# EasyEDA Pro project ProDoc_PCB1_2026-03-28.epro

# Board PCB1
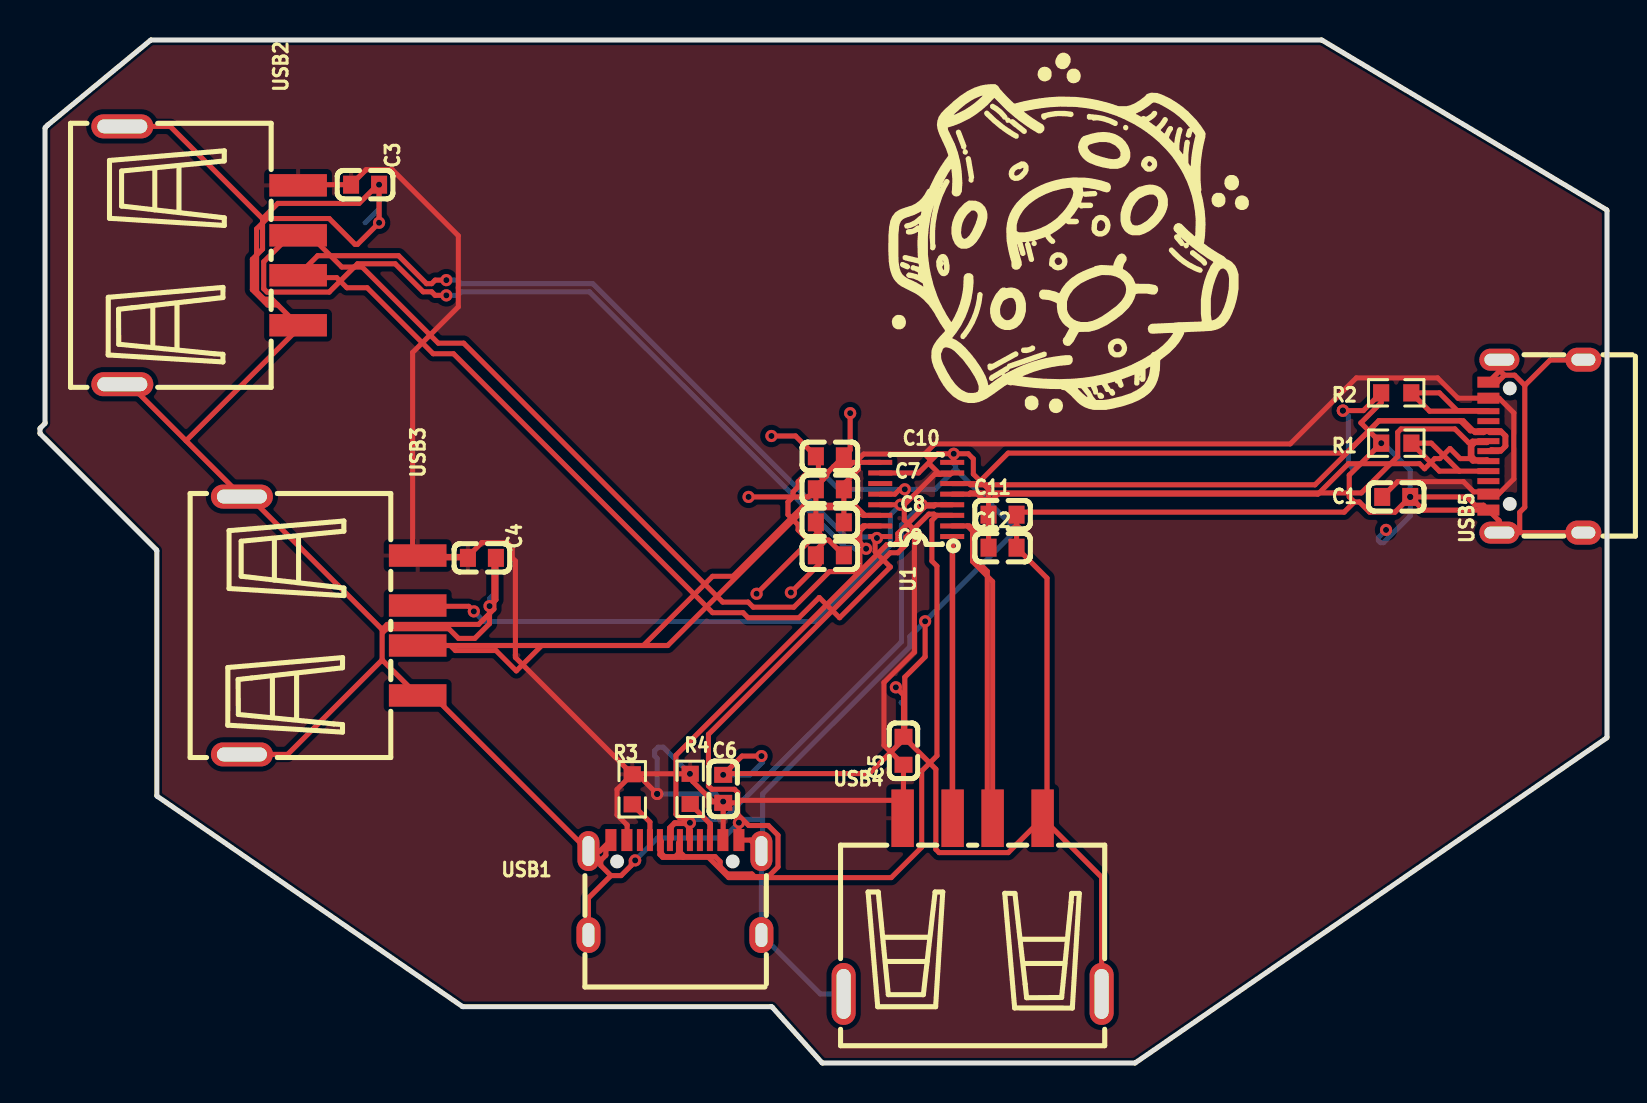
[diagram p0: board, top side]
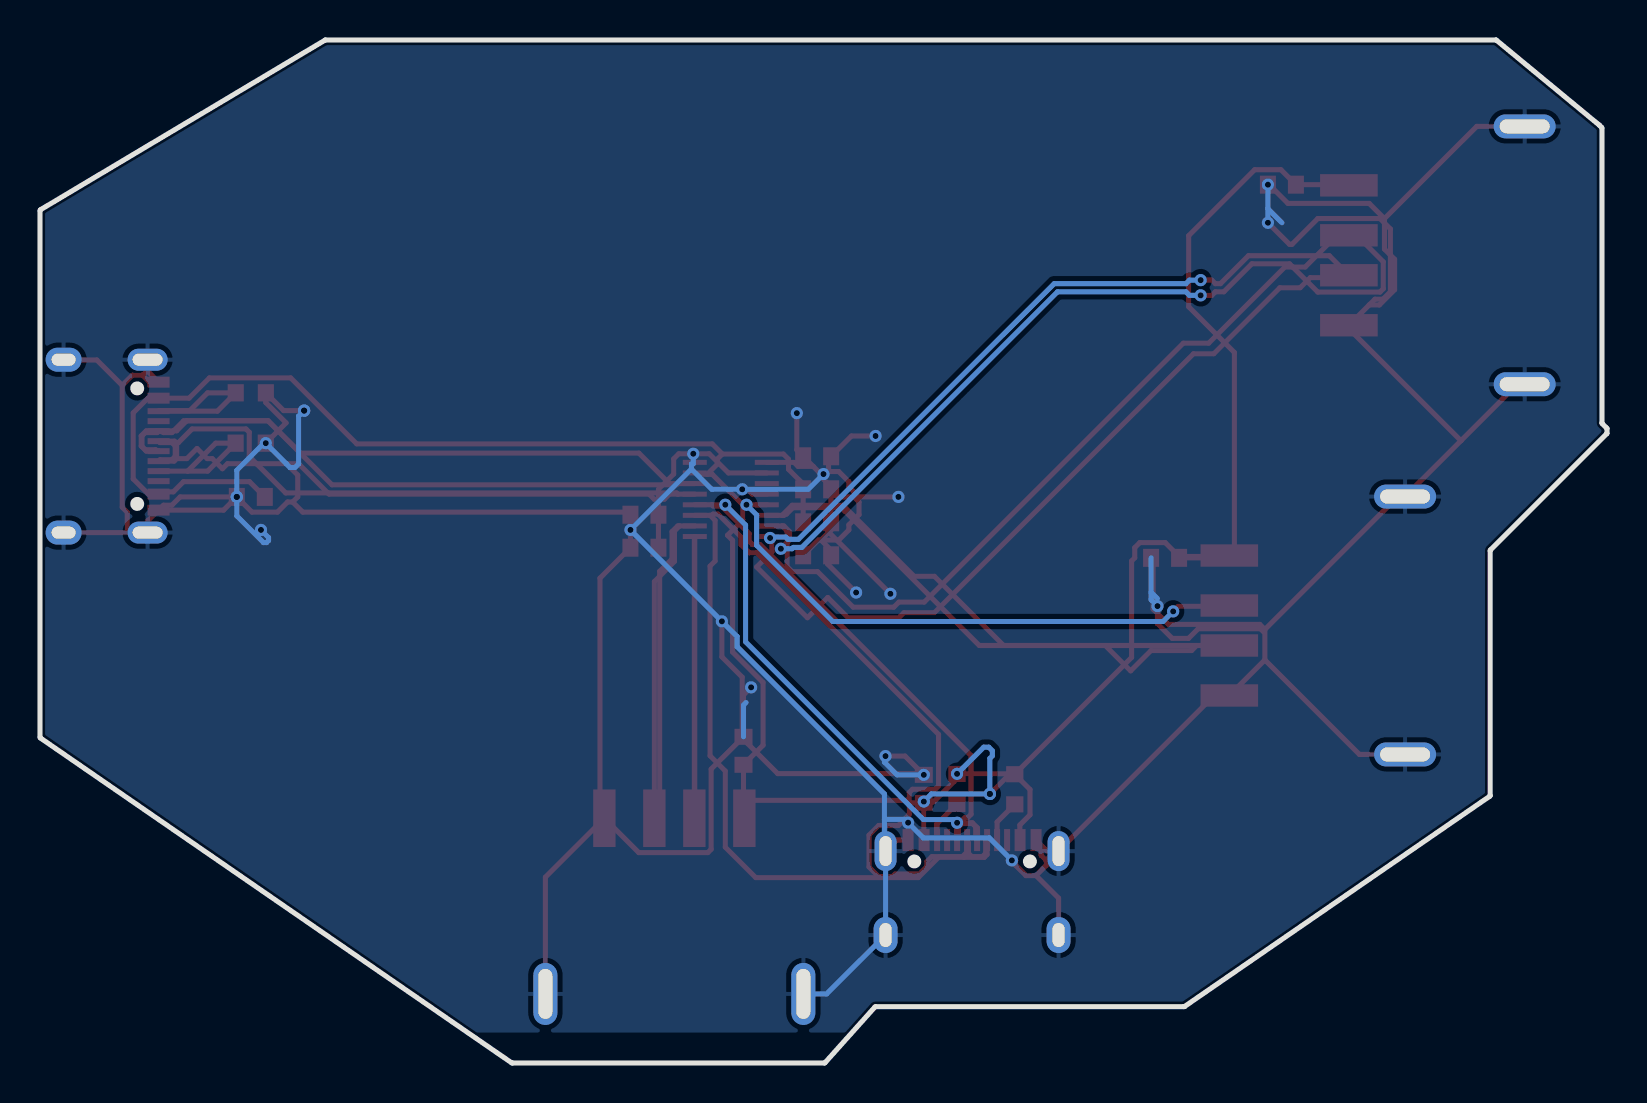
[diagram p1: board, bottom side, seen from below]

Outline 78.36 x 51.18 mm; copper layers: Top Layer, Bottom Layer. Coordinates in mm from the lower left corner of the outline.
Outline path: 0,31.73 arc(0,31.75) 0.02,31.77 0.24,31.99 arc(0.25,32.01) 0.25,32.03 0.25,46.77 arc(0.26,46.79) 0.27,46.81 0.38,46.92 arc(0.38,46.92) 0.38,46.92 5.53,51.17 arc(5.54,51.18) 5.56,51.18 64.08,51.18 arc(64.09,51.18) 64.1,51.17 78.33,42.69 arc(78.35,42.67) 78.36,42.64 78.36,16.3 arc(78.35,16.28) 78.34,16.26 54.77,0.01 arc(54.76,0) 54.74,0 39.14,0 arc(39.12,0) 39.1,0.02 36.61,2.8 arc(36.59,2.82) 36.57,2.82 21.15,2.82 arc(21.14,2.82) 21.12,2.83 5.86,13.35 arc(5.85,13.36) 5.84,13.39 5.84,25.63 arc(5.84,25.65) 5.83,25.67 0.02,31.48 arc(0,31.5) 0,31.52 0,31.73
Stack: Top Layer 0.035mm / Dielectric1 1.51mm FR4 er 4.5 / Bottom Layer 0.035mm

## Design rules (mm)
net DN2: DP3
net DP2: DP3
net DN1: DP2
net DP1: DP2
net DN: DP1
net DP: DP1
net DN4: DP5
net DP4: DP5
net DN3: DP4
net DP3: DP4
template: Custom Config
spacing copperThickness1oz (default): track to track 0.102, other pairs 0.152 to 0.3
spacing copperThickness2oz: track to track 0.203, other pairs 0.152 to 0.3
track width copperThickness1oz (default): min 0.127, default 0.254, max 2.54
track width copperThickness2oz: min 0.203, default 0.254, max 2.54
differential pair differentialPair (default): width min 0.127, default 0.254, max 2.54; gap min 0.152, default 0.152
via viaSize (default): diameter min 0.5, default 0.61, max 10; hole min 0.3, default 0.305, max 6.3

## Placement (name value [footprint] x y rotation side)
C1  1uf  [C0603]  67.82 28.32 0 top
C3  1uf  [C0603]  16.26 43.94 0 top
C4  1uf  [C0603]  22.1 25.27 0 top
C5  1uf  [C0603]  43.18 15.62 90 top
C6  1uf  [C0603]  34.16 13.72 90 top
C7  100nf  [C0603]  39.5 28.7 180 top
C8  1uf  [C0603]  39.5 27.05 180 top
C9  100nf  [C0603]  39.5 25.4 180 top
C10  1uf  [C0603]  39.5 30.35 180 top
C11  100nf  [C0603]  48.13 27.43 0 top
C12  1uf  [C0603]  48.13 25.78 0 top
R1  5.1K  [R0603]  67.82 31.01 0 top
R2  5.1K  [R0603]  67.82 33.53 0 top
R3  5.1K  [R0603]  29.62 13.69 90 top
R4  5.1K  [R0603]  32.51 13.72 90 top
U1  SL2.1s  [SSOP-16_L4.6-W2.6-P0.53-LS4.0-BL]  43.81 28.19 90 top
USB1  TYPE-C 16PIN 2MD(073)  [USB-C-SMD_TYPE-C-6PIN-2MD-073]  31.75 8.78 0 top
USB2  10.0 QHHTZB6.3  [USB-A-TH_10.0QHHTZB6.3]  8.51 40.41 270 top
USB3  10.0 QHHTZB6.3  [USB-A-TH_10.0QHHTZB6.3]  14.49 21.89 270 top
USB4  10.0 QHHTZB6.3  [USB-A-TH_10.0QHHTZB6.3]  46.64 7.85 0 top
USB5  TYPE-C 16PIN 2MD(073)  [USB-C-SMD_TYPE-C-6PIN-2MD-073]  74.8 30.86 90 top

## Footprints (pads in the part's own frame, mm; a bottom-side part is the same pattern mirrored in y, then rotated)
C0603
  rect 0.8x0.9 smd: 1(-0.7,0) 2(0.7,0)
R0603
  rect 0.806x0.864 smd: 1(-0.753,0) 2(0.753,0)
SSOP-16_L4.6-W2.6-P0.53-LS4.0-BL
  rect 0.25x1.2 smd: 1(-1.855,-1.8) 2(-1.325,-1.8) 3(-0.795,-1.8) 4(-0.265,-1.8) 5(0.265,-1.8) 6(0.795,-1.8) 7(1.325,-1.8) 8(1.855,-1.8) 9(1.855,1.8) 10(1.325,1.8) 11(0.795,1.8) 12(0.265,1.8) 13(-0.265,1.8) 14(-0.795,1.8) 15(-1.325,1.8) 16(-1.855,1.8)
USB-A-TH_10.0QHHTZB6.3
  rect 1.12x2.88 smd: 1(-3.5,4.395) 2(-1,4.395) 3(1,4.395) 4(3.5,4.395)
  oval 1.2x3.1 hole 0.7x2.5: 5(-6.45,-4.395) 6(6.45,-4.395)
USB-C-SMD_TYPE-C-6PIN-2MD-073
  rect 0.55x1.1 smd: 1(-3.2,2.375) 2(-2.4,2.375) 11(2.4,2.375) 12(3.2,2.375)
  rect 0.3x1.1 smd: 3(-1.75,2.375) 4(-1.25,2.375) 5(-0.75,2.375) 6(-0.25,2.375) 7(0.25,2.375) 8(0.75,2.375) 9(1.25,2.375) 10(1.75,2.375)
  oval 1.1x2 hole 0.6x1.5: 13(-4.325,1.825) 14(4.325,1.825)
  oval 1.2x1.8 hole 0.6x1.2: 13(-4.325,-2.375) 14(4.325,-2.375)

## Nets
+5V: C1.1 C3.1 C4.1 C5.1 C6.1 C7.1 C8.1 R3.2 R4.2 U1.7 USB1.2 USB1.11 USB2.1 USB3.1 USB4.1 USB5.2 USB5.11
GND: C1.2 C3.2 C4.2 C5.2 C6.2 C7.2 C8.2 C9.2 C10.2 C11.2 C12.2 R1.1 R2.1 U1.8 U1.12 USB1.1 USB1.12 USB1.13 USB1.14 USB2.4 USB2.5 USB2.6 USB3.4 USB3.5 USB3.6 USB4.4 USB4.5 USB4.6 USB5.1 USB5.12 USB5.13 USB5.14
DN: U1.5 USB5.5 USB5.7
DN1: U1.3 USB1.5 USB1.7
DN2: U1.1 USB4.2
DN3: U1.15 USB2.2
DN4: U1.13 USB3.2
DP: U1.6 USB5.6 USB5.8
DP1: U1.4 USB1.6 USB1.8
DP2: U1.2 USB4.3
DP3: U1.16 USB2.3
DP4: U1.14 USB3.3
$1N1011: R1.2 USB5.4
$1N1015: R2.2 USB5.10
$1N1711: R3.1 USB1.4
$1N1796: R4.1 USB1.10
$1N2506: C9.1 C10.1 U1.9
$1N2528: C11.1 C12.1 U1.10

Pads without a net: U1 11; USB1 3 9; USB5 3 9

## Via types
v1: diameter 0.61, hole 0.305, Top Layer to Bottom Layer, 36 vias

## Routing (per net, layer and track width the routed paths; a pad name or vN(x,y) marks a point on that pad's centre or on a via; arc(x,y) is an arc through that point)
+5V: length 150.1
  Top Layer w0.25: U1.7 45.5,29.45 45,29.45 44.49,29.96 44.49,30.21 44.23,30.47 ; 44.23,30.47 41.19,30.47 40.93,30.21 40.93,29.7 40.2,28.97 C7.1 ; 44.23,30.47 44.74,30.97 62.52,30.97 65.82,34.28 69.89,34.28 70.9,33.26 USB5.11
  Top Layer w0.254: 21.4,25.34 C4.1 19,25.27 18.89,25.39 ; 21.4,25.34 22.09,26.03 23.36,26.03 23.62,25.78 23.62,25.27 23.77,25.12 23.77,20.29 R3.2 ; 21.4,25.34 19.11,25.34 18.89,25.39 ; 43.18,13.14 43.18,12.29 ; 43.18,13.14 C5.1 42.2,15.9 42.2,19.04 43.73,20.56 43.73,26.15 43.98,26.4 43.22,27.17 43.22,27.93 44.74,29.45 45,29.45 ; 43.18,13.14 35.05,13.14 34.92,13.02 34.16,13.02 ; 43.18,12.29 USB4.1 43.18,12.13 43.18,12.29 ; 34.16,11.49 USB1.11 34.16,11.17 34.16,13.02 ; R3.2 29.72,14.47 R4.2 32.64,14.34 32.64,14.09 33.66,13.07 33.91,13.07 33.91,13.02 34.16,13.02 ; R3.2 28.85,13.69 28.85,12.42 29.36,11.91 29.36,11.4 USB1.2 ; R3.2 29.88,14.45 v1(30.86,13.46) ; 18.89,25.39 18.63,25.64 18.63,35.55 20.92,37.83 20.92,41.39 17.62,44.69 16.31,44.69 C3.1 12.94,43.94 USB2.1 13.27,43.94 ; USB5.11 72.96,33.26 73.7,32.53 73.7,29.22 72.94,28.46 USB5.2 72.31,28.58 71.69,28.58 71.18,29.08 67.88,29.08 C1.1 ; C7.1 C8.1
  Bottom Layer w0.254: v1(32.5,14.47) 31.17,15.8 30.91,15.8 30.73,15.62 30.73,15.37 30.86,15.24 v1(30.86,13.46) 33.78,13.46 v1(34.16,13.08)
GND: length 331.6
  Top Layer w0.25: C7.2 38.8,28.83 39.18,29.21 v1(39.18,29.46) ; v1(45.69,30.48) 45.69,30.23 U1.8 ; v1(43.25,28.7) 42.99,28.7 42.75,28.46 U1.12
  Top Layer w0.254: 11.13,42.03 11.35,42.25 14.46,42.25 15.75,40.96 15.88,40.96 v1(16.96,42.04) v1(16.96,43.94) 16.89,43.94 15.95,43 11.89,43 11.13,42.24 ; 11.13,42.03 11.13,42.24 ; 11.13,42.03 11.13,40.72 10.83,40.42 ; 11.13,42.03 10.83,41.73 10.83,40.42 ; USB4.4 53.09,9.3 USB4.6 ; USB4.4 50.36,12.47 50.36,24.26 C12.2 v1(48.83,26.67) C11.2 48.96,27.56 65.22,27.56 65.72,28.07 ; USB4.4 48.42,10.53 44.96,10.53 44.8,10.69 44.8,14.7 C5.2 ; 28.55,9.38 29.06,9.38 29.57,9.88 29.57,10.14 v1(29.76,10.14) ; 28.55,9.38 27.42,8.25 USB1.13 ; 28.55,9.38 28.04,9.88 28.04,10.14 ; 22.7,23.08 22.7,25.17 C4.2 22.8,23.18 22.7,23.08 ; 22.7,23.08 22.7,22.71 22.48,22.49 ; 22.7,23.08 v1(22.48,22.86) 22.48,22.49 ; C8.2 38.8,26.67 38.91,26.55 ; C8.2 38.98,26.87 38.98,26.62 38.91,26.55 ; C8.2 C7.2 38.42,28.32 v1(35.43,28.32) ; 38.91,26.55 v1(35.83,23.47) ; 38.91,26.55 39.31,26.16 38.8,25.65 C9.2 38.98,25.22 38.98,24.97 v1(37.55,23.54) ; v1(68.52,28.32) 67.76,27.56 66.49,27.56 65.98,28.07 65.72,28.07 ; v1(68.52,28.32) 71.35,28.32 71.76,27.91 72.18,27.91 USB5.1 ; v1(68.52,28.32) 69.18,27.66 USB5.1 ; 11.13,42.24 6.51,46.86 USB2.5 ; 65.72,28.07 65.47,28.32 65.47,29.41 v1(67.07,31.01) 66.05,32.03 67.07,33.04 67.07,33.3 R2.1 66.18,32.64 v1(65.15,32.64) ; 72.94,27.15 72.94,26.64 USB5.13 ; 72.94,27.15 USB5.1 ; 72.94,27.15 72.98,27.11 USB5.13 ; 43.18,16.44 42.99,16.26 42.99,16 41.47,14.48 34.35,14.48 34.29,14.42 v1(34.16,14.42) 35.1,15.36 v1(36.08,15.36) ; 43.18,16.44 43.18,18.42 v1(42.8,18.8) ; 43.18,16.44 43.25,16.51 ; 43.18,16.44 C5.2 ; 43.25,16.51 C5.2 ; 43.25,16.51 43.25,19.3 44.26,20.32 v1(44.26,22.1) ; v1(34.95,12.02) USB1.12 35.52,11.15 USB1.14 ; 17.11,21.69 10.5,28.29 10.25,28.29 10.1,28.34 7.3,31.13 ; 17.11,21.69 17.11,20.17 ; 17.11,21.69 17.36,21.94 21.93,21.94 22.48,22.49 ; 11.89,37.92 11.38,37.92 10.62,38.69 10.62,40.21 10.83,40.42 ; 11.89,37.92 USB2.4 12.89,36.89 12.89,36.72 7.3,31.13 ; 11.89,37.92 11.6,38.21 11.2,38.21 10.83,38.59 10.83,40.42 ; USB5.13 73.99,26.54 ; 28.04,10.14 28.3,10.39 28.3,10.65 28.55,10.9 USB1.1 28,10.6 USB1.13 19.64,18.39 18.89,18.39 17.11,20.17 ; 28.04,10.14 27.58,10.6 ; 17.11,20.17 17.11,20.11 ; 17.11,20.17 12.38,15.44 USB3.6 ; 22.48,22.49 22.48,21.98 21.74,21.24 20.93,21.24 20.44,21.73 17.33,21.73 17.17,21.56 ; 73.23,34.41 73.74,34.41 74.25,33.9 ; 73.23,34.41 72.98,34.66 ; 73.23,34.41 72.88,34.06 USB5.12 72.98,34.61 72.98,34.66 ; v1(36.58,31.37) 37.78,31.37 C10.2 38.8,30.35 38.93,30.23 38.93,29.72 v1(39.18,29.46) ; 72.98,34.66 72.98,35.19 ; 7.3,31.13 4.48,33.96 USB2.6 ; 40.2,30.35 40.51,30.67 v1(40.51,32.51) ; 74.25,33.9 74.25,27.81 73.99,27.55 73.99,26.54 ; 74.25,33.9 75.52,35.17 77.04,35.17 77.18,35.19 ; 73.99,26.54 USB5.13
  Bottom Layer w0.25: v1(45.69,30.48) 45.69,29.97 45.78,29.97 45.78,29.72 ; v1(39.18,29.46) 39.94,28.7 v1(43.25,28.7) 44.77,28.7 45.78,29.72 ; 45.78,29.72 v1(48.83,26.67)
  Bottom Layer w0.254: 36.13,12.19 36.13,13.46 43.5,20.83 43.5,21.34 v1(44.26,22.1) v1(48.83,26.67) ; 36.13,12.19 35.12,12.19 v1(34.95,12.02) 34.19,11.26 30.89,11.26 v1(29.76,10.14) ; 36.13,12.19 36.13,10.67 36.07,10.61 USB1.14 39.02,3.46 USB4.5 ; v1(22.48,22.86) 22.8,23.18 22.8,23.56 ; 16.96,42.74 v1(16.96,42.04) ; 16.96,42.74 v1(16.96,43.94) ; 16.96,42.74 16.26,42.04 ; C4.2 22.8,23.56 ; 22.8,23.56 22.48,23.24 ; v1(65.15,32.64) 65.43,32.36 65.43,29.97 65.61,29.79 65.86,29.79 66.04,29.97 66.04,29.98 v1(67.07,31.01) ; v1(67.31,26.67) 66.93,26.29 66.93,26.14 67.03,26.03 67.18,26.03 68.52,27.37 v1(68.52,28.32) 68.52,29.65 67.11,31.06 ; v1(36.08,15.36) 36.13,15.3 36.13,15.05 35.5,14.42 v1(34.16,14.42) ; C5.2 43.18,17.91 43.05,18.03
DN: length 60.2
  Top Layer w0.25: USB5.5 71.65,30.11 71.52,30.24 71.01,30.24 70.51,30.75 70,30.24 69.75,30.24 69.24,29.73 68.98,29.98 65.43,29.98 63.9,28.46 47.9,28.46 47.65,28.2 47.14,28.2 46.88,28.46 46.47,28.46
  Top Layer w0.254: 71.76,31.04 72.36,31.04 USB5.7 71.63,31.11 71.56,31.04 ; 71.76,31.04 71.6,30.88 71.6,30.35 71.76,30.18 72.36,30.18 USB5.5 ; 71.76,31.04 71.56,31.04 ; 71.56,31.04 71.52,31 71.52,30.24 ; 71.56,31.04 71.44,31.04 70.75,31.72 68.06,31.72 67.89,31.56 67.89,30.34 67.54,29.98 66.07,28.52 46.53,28.52 46.47,28.46 U1.5
DN1: length 67.4
  Top Layer w0.25: 44.85,27.4 44.6,27.14 44.6,25.11 44.85,24.86 44.85,15.37 44.09,14.61 44.09,10.8 42.57,9.28 34.44,9.28 33.42,10.29 32.15,10.29 32,10.44 32,10.56
  Top Layer w0.254: U1.3 44.76,27.4 44.7,27.46 44.45,27.46 43.3,26.32 43.3,25.93 42.9,25.53 42.51,25.53 33.43,16.44 33.43,13.87 33.6,13.69 34.73,13.69 34.89,13.53 34.89,12.43 35.44,11.88 36.42,11.88 36.9,11.4 36.9,9.81 36.42,9.33 35.73,9.33 35.6,9.45 34.38,9.45 34.01,9.82 34.01,10.07 33.76,10.33 32.23,10.33 32,10.56 USB1.7 31.98,11.13 31.98,11.06 31.93,11.01 31.93,10.49 31.76,10.33 31.23,10.33 31.07,10.49 31.07,11.08 USB1.5 31,10.43 31.14,10.29 32.15,10.29
DN2: length 28.4
  Top Layer w0.25: U1.1 45.61,12.88 45.87,12.62 45.87,12.48 USB4.2
  Top Layer w0.254: USB4.2 45.64,26.32 U1.1
DN3: length 81.5
  Top Layer w0.25: 41.25,26.87 41,26.61 41,24.84 40.75,24.58 39.47,24.58 37.7,22.8 35.66,22.8 35.41,23.06 34.14,23.06 21.19,36.01 19.92,36.01 16.11,39.82 15.09,39.82 13.57,41.35 13.06,41.35 USB2.2
  Top Layer w0.254: USB2.2 12.51,41.41 11.19,40.08 11.19,38.73 11.35,38.57 14.46,38.57 15.88,39.98 17.76,39.98 19.16,38.58 19.58,38.58 19.76,38.41 v1(20.32,38.41) ; U1.15 41.16,26.87 40.88,26.58 40.88,26.16 v1(41.31,25.73)
  Bottom Layer w0.254: v1(41.31,25.73) 40.75,25.73 40.69,25.79 40.26,25.79 27.48,38.58 21.06,38.58 20.88,38.41 v1(20.32,38.41)
DN4: length 28.8
  Top Layer w0.25: v1(21.69,22.59) 21.44,22.85 19.16,22.85 18.89,22.89 ; U1.13 v1(43.03,27.93)
  Bottom Layer w0.25: v1(21.69,22.59) 22.2,22.09 38.71,22.09 42.52,25.9 42.52,27.42 v1(43.03,27.93)
DP: length 60.9
  Top Layer w0.25: 46.47,28.99 46.88,28.99 48.41,30.51 65.33,30.51 66.95,32.14 71.01,32.14 71.52,31.63 73.05,31.63 73.3,31.37 73.3,30.86 73.05,30.61 USB5.6
  Top Layer w0.254: USB5.8 72.26,31.61 72.19,31.54 71.76,31.54 71.17,32.13 66.96,32.13 63.76,28.93 46.53,28.93 46.47,28.99 U1.6 ; USB5.8 72.54,31.63 ; USB5.8 72.5,31.54 73.09,31.54 73.26,31.38 73.26,30.85 73.09,30.68 72.57,30.68 72.53,30.63 72.45,30.63 USB5.6
DP1: length 50.4
  Top Layer w0.25: 44.76,27.93 v1(44.09,27.93) ; v1(32.5,12.02) 32.5,11.89
  Top Layer w0.254: v1(32.5,12.02) 32.37,12.02 ; 32.37,12.02 32.11,12.28 31.96,12.28 31.8,12.44 31.8,15.39 42.34,25.94 42.73,25.94 42.89,26.1 42.89,26.48 44.28,27.87 44.7,27.87 44.76,27.93 U1.4 ; 32.37,12.02 32.5,11.89 USB1.8 32.43,11.22 32.43,11.82 32.26,11.98 31.73,11.98 31.57,11.82 31.57,11.22 USB1.6 31.48,11.26 31.48,11.77 31.74,12.02 32.37,12.02
  Bottom Layer w0.25: v1(32.5,12.02) 32.66,12.18 34.19,12.18 43.07,21.07 43.07,26.91 v1(44.09,27.93)
DP2: length 30.9
  Top Layer w0.25: 46.38,26.87 46.63,26.61 46.63,25.09 47.37,24.35 47.64,24.09 47.64,12.41
  Top Layer w0.254: USB4.3 47.64,12.41 47.37,12.68 47.37,24.6 46.75,25.22 46.75,26.58 46.47,26.87 U1.2
DP3: length 76.2
  Top Layer w0.25: U1.16 41.76,26.08 41.76,25.58 42.52,24.81 39.98,22.28 38.97,23.29 37.95,22.28 35.41,22.28 35.16,22.53 33.63,22.53 20.68,35.48 19.66,35.48 16.36,38.78 15.34,38.78 14.84,39.29 13.06,39.29 USB2.3
  Top Layer w0.254: USB2.3 13.89,40.39 17.93,40.39 19.33,38.99 19.58,38.99 19.76,39.17 v1(20.32,39.17) ; U1.16 41.92,26.34 v1(41.85,26.27)
  Bottom Layer w0.254: v1(41.85,26.27) 41.81,26.31 41.07,26.31 40.96,26.2 40.43,26.2 27.64,38.99 21.06,38.99 20.88,39.17 v1(20.32,39.17)
DP4: length 46
  Top Layer w0.25: 30.17,20.89 33.63,24.35 34.65,24.35 38.2,27.91 40.75,27.91 41.25,27.4 ; 25.09,20.89 23.82,19.62 22.8,20.63 20.77,20.63 20.52,20.89
  Top Layer w0.254: U1.14 41.16,27.4 41.1,27.46 41.03,27.46 40.71,27.78 38.28,27.78 31.39,20.89 18.89,20.89
$1N1011: length 7.4
  Top Layer w0.254: 70.97,29.61 USB5.4 ; 70.97,29.61 69.57,31.01 R1.2 69.97,29.61 70.97,29.61
$1N1015: length 8.5
  Top Layer w0.254: 69.49,32.61 USB5.10 72.4,32.64 70.87,32.64 69.98,33.53 R2.2 69.49,32.61
$1N1711: length 2.2
  Top Layer w0.254: R3.1 30.5,12.06 USB1.4
$1N1796: length 3.1
  Top Layer w0.254: 33.5,11.97 33.53,11.95 33.53,11.44 USB1.10 33.5,11.97 ; 33.5,11.97 R4.1
$1N2506: length 10.9
  Top Layer w0.25: U1.9 40.66,30.05 40.45,29.84 39.69,29.84
  Top Layer w0.254: C10.1 39.44,29.59 38.42,29.59 37.91,29.08 37.91,28.83 37.66,28.58 37.66,28.32 37.4,28.07 37.4,27.43 37.91,26.92 37.91,26.67 38.42,26.16 39.44,26.16 C9.1
$1N2528: length 9.9
  Top Layer w0.25: C11.1 47.43,28.7 46.67,29.46 46.67,30.23 46.42,30.48 44.89,30.48 43.93,29.52 U1.10
  Top Layer w0.254: C11.1 C12.1

## Copper pours and planes (outline as drawn; the poured copper is in the pictures)
+5V on Top Layer: -5.33,56.01 84.96,56.01 84.96,-0.25 -5.33,-0.25
GND on Bottom Layer: -3.43,53.34 85.34,53.34 85.34,1.52 -3.43,1.52
